# EAGLE design Pots (EAGLE 7.4.0)
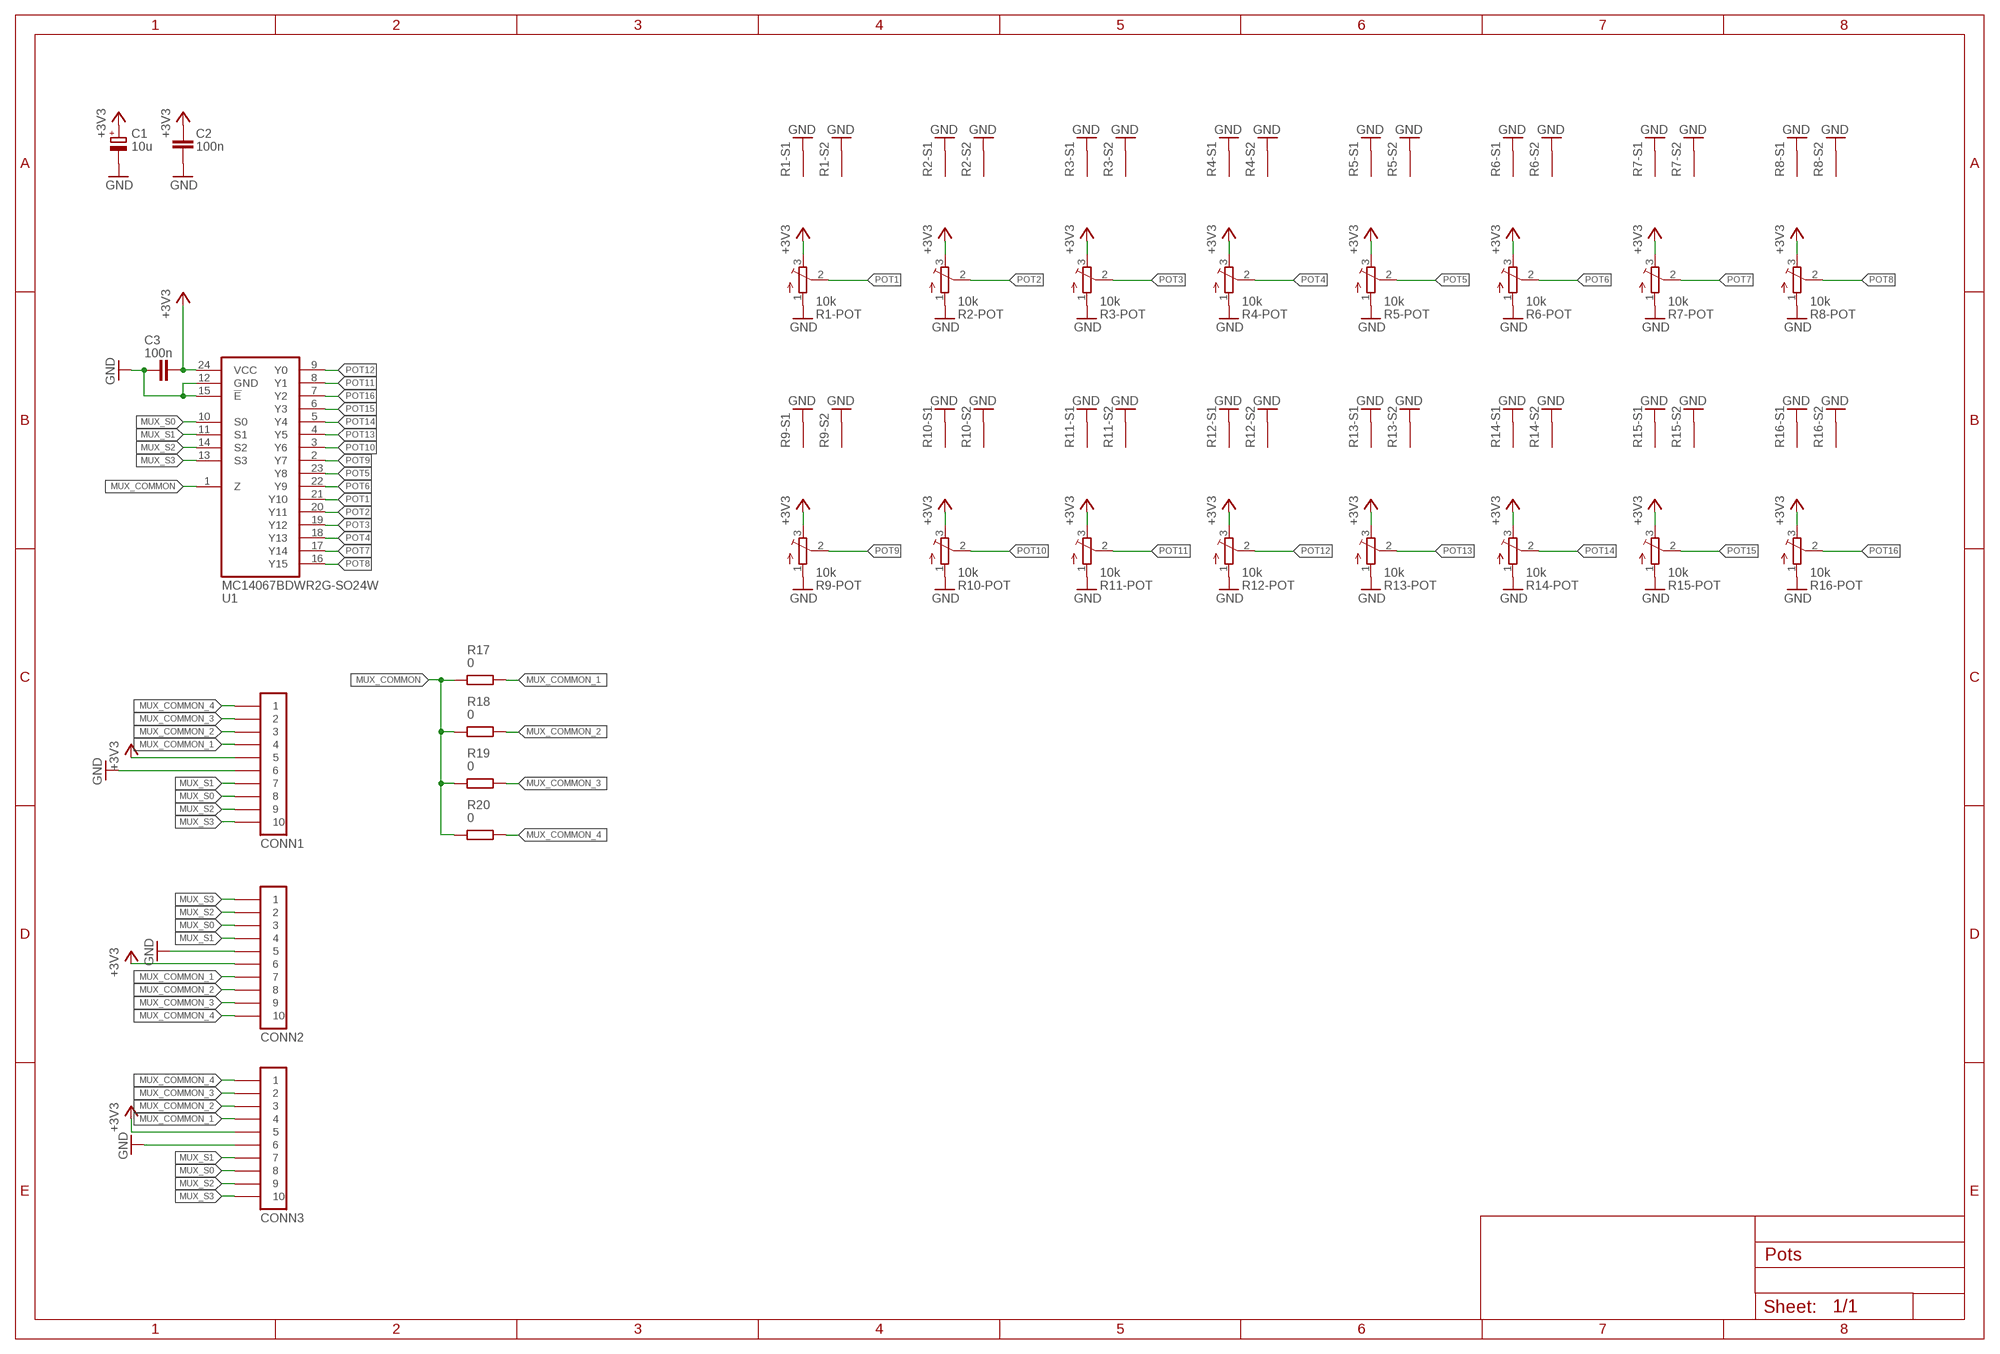
[diagram p0: schematic, sheet 1]

## Parts
C1  10u  ELECTROLYTIC_CAPACITOR-C-TH-E-0401  [C-TH-E-0401]
C2  100n  CAPACITOR-0805  [C0805]
C3  100n  CAPACITOR-0805  [C0805]
CONN1  PINHD-1X10-FFC-1MM-Z  [MOLEX-52271-1079]
CONN2  PINHD-1X10-FFC-1MM-Z  [MOLEX-52271-1079]
CONN3  PINHD-1X10-FFC-1MM-Z  [MOLEX-52271-1079]
R1  10k  PTV09A-4025F-B103  [PTV09A-4025F-B103]
R2  10k  PTV09A-4025F-B103  [PTV09A-4025F-B103]
R3  10k  PTV09A-4025F-B103  [PTV09A-4025F-B103]
R4  10k  PTV09A-4025F-B103  [PTV09A-4025F-B103]
R5  10k  PTV09A-4025F-B103  [PTV09A-4025F-B103]
R6  10k  PTV09A-4025F-B103  [PTV09A-4025F-B103]
R7  10k  PTV09A-4025F-B103  [PTV09A-4025F-B103]
R8  10k  PTV09A-4025F-B103  [PTV09A-4025F-B103]
R9  10k  PTV09A-4025F-B103  [PTV09A-4025F-B103]
R10  10k  PTV09A-4025F-B103  [PTV09A-4025F-B103]
R11  10k  PTV09A-4025F-B103  [PTV09A-4025F-B103]
R12  10k  PTV09A-4025F-B103  [PTV09A-4025F-B103]
R13  10k  PTV09A-4025F-B103  [PTV09A-4025F-B103]
R14  10k  PTV09A-4025F-B103  [PTV09A-4025F-B103]
R15  10k  PTV09A-4025F-B103  [PTV09A-4025F-B103]
R16  10k  PTV09A-4025F-B103  [PTV09A-4025F-B103]
R17  0  RESISTOR-0805  [R0805]
R18  0  RESISTOR-0805  [R0805]
R19  0  RESISTOR-0805  [R0805]
R20  0  RESISTOR-0805  [R0805]
U1  MC14067BDWR2G-SO24W  [SO24-W]

## Nets
+3V3: C1.+ C2.1 C3.2 CONN1.5 CONN2.6 CONN3.5 R1.3 R2.3 R3.3 R4.3 R5.3 R6.3 R7.3 R8.3 R9.3 R10.3 R11.3 R12.3 R13.3 R14.3 R15.3 R16.3 U1.24(VCC)
GND: C1.- C2.2 C3.1 CONN1.6 CONN2.5 CONN3.6 R1.1 R1.S1(-S1:S) R1.S2(-S2:S) R2.1 R2.S1(-S1:S) R2.S2(-S2:S) R3.1 R3.S1(-S1:S) R3.S2(-S2:S) R4.1 R4.S1(-S1:S) R4.S2(-S2:S) R5.1 R5.S1(-S1:S) R5.S2(-S2:S) R6.1 R6.S1(-S1:S) R6.S2(-S2:S) R7.1 R7.S1(-S1:S) R7.S2(-S2:S) R8.1 R8.S1(-S1:S) R8.S2(-S2:S) R9.1 R9.S1(-S1:S) R9.S2(-S2:S) R10.1 R10.S1(-S1:S) R10.S2(-S2:S) R11.1 R11.S1(-S1:S) R11.S2(-S2:S) R12.1 R12.S1(-S1:S) R12.S2(-S2:S) R13.1 R13.S1(-S1:S) R13.S2(-S2:S) R14.1 R14.S1(-S1:S) R14.S2(-S2:S) R15.1 R15.S1(-S1:S) R15.S2(-S2:S) R16.1 R16.S1(-S1:S) R16.S2(-S2:S) U1.12(GND) U1.15(!E)
MUX_COMMON: R17.1 R18.1 R19.1 R20.1 U1.1(Z)
MUX_COMMON_1: CONN1.4 CONN2.7 CONN3.4 R17.2
MUX_COMMON_2: CONN1.3 CONN2.8 CONN3.3 R18.2
MUX_COMMON_3: CONN1.2 CONN2.9 CONN3.2 R19.2
MUX_COMMON_4: CONN1.1 CONN2.10 CONN3.1 R20.2
MUX_S0: CONN1.8 CONN2.3 CONN3.8 U1.10(S0)
MUX_S1: CONN1.7 CONN2.4 CONN3.7 U1.11(S1)
MUX_S2: CONN1.9 CONN2.2 CONN3.9 U1.14(S2)
MUX_S3: CONN1.10 CONN2.1 CONN3.10 U1.13(S3)
POT1: R1.2 U1.21(Y10)
POT2: R2.2 U1.20(Y11)
POT3: R3.2 U1.19(Y12)
POT4: R4.2 U1.18(Y13)
POT5: R5.2 U1.23(Y8)
POT6: R6.2 U1.22(Y9)
POT7: R7.2 U1.17(Y14)
POT8: R8.2 U1.16(Y15)
POT9: R9.2 U1.2(Y7)
POT10: R10.2 U1.3(Y6)
POT11: R11.2 U1.8(Y1)
POT12: R12.2 U1.9(Y0)
POT13: R13.2 U1.4(Y5)
POT14: R14.2 U1.5(Y4)
POT15: R15.2 U1.6(Y3)
POT16: R16.2 U1.7(Y2)

## Library data of the parts
C1 = igor_lbr:ELECTROLYTIC_CAPACITOR: Electrolytic capacitor
C2 C3 = igor_lbr:CAPACITOR: Capacitor
CONN1-CONN3 = igor_lbr:PINHD-1X10: Pin header; MANUFACTURER: Molex; MPN: 52271-1079
R1-R16 = igor_lbr:PTV09A-4025F-B103: Potentiometer
R17-R20 = igor_lbr:RESISTOR: Resistor
U1 = igor_lbr:MC14067BDWR2G: 16-Channel Analog Multiplexer/Demultiplexer; MANUFACTURER: ON Semiconductor; MPN: MC14067BDWR2G

## Board
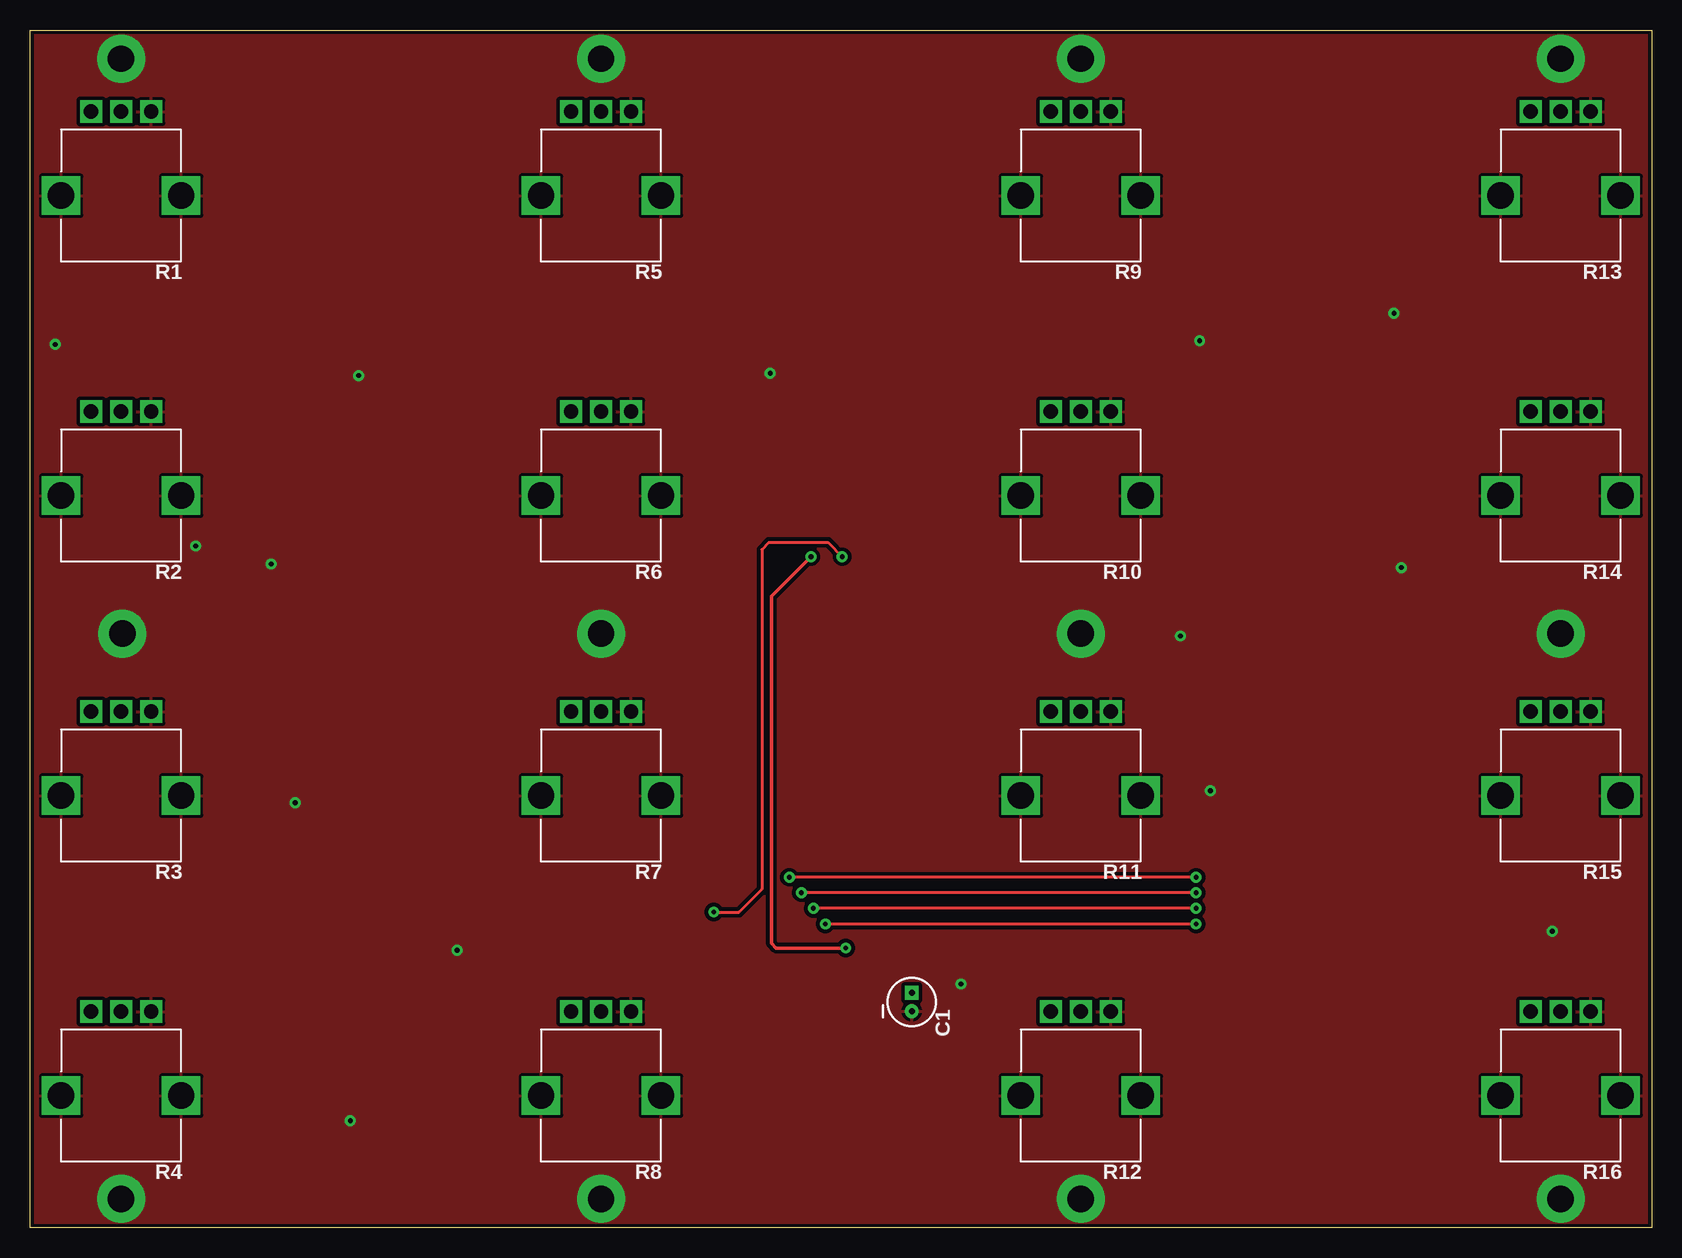
[diagram p1: board, top side]
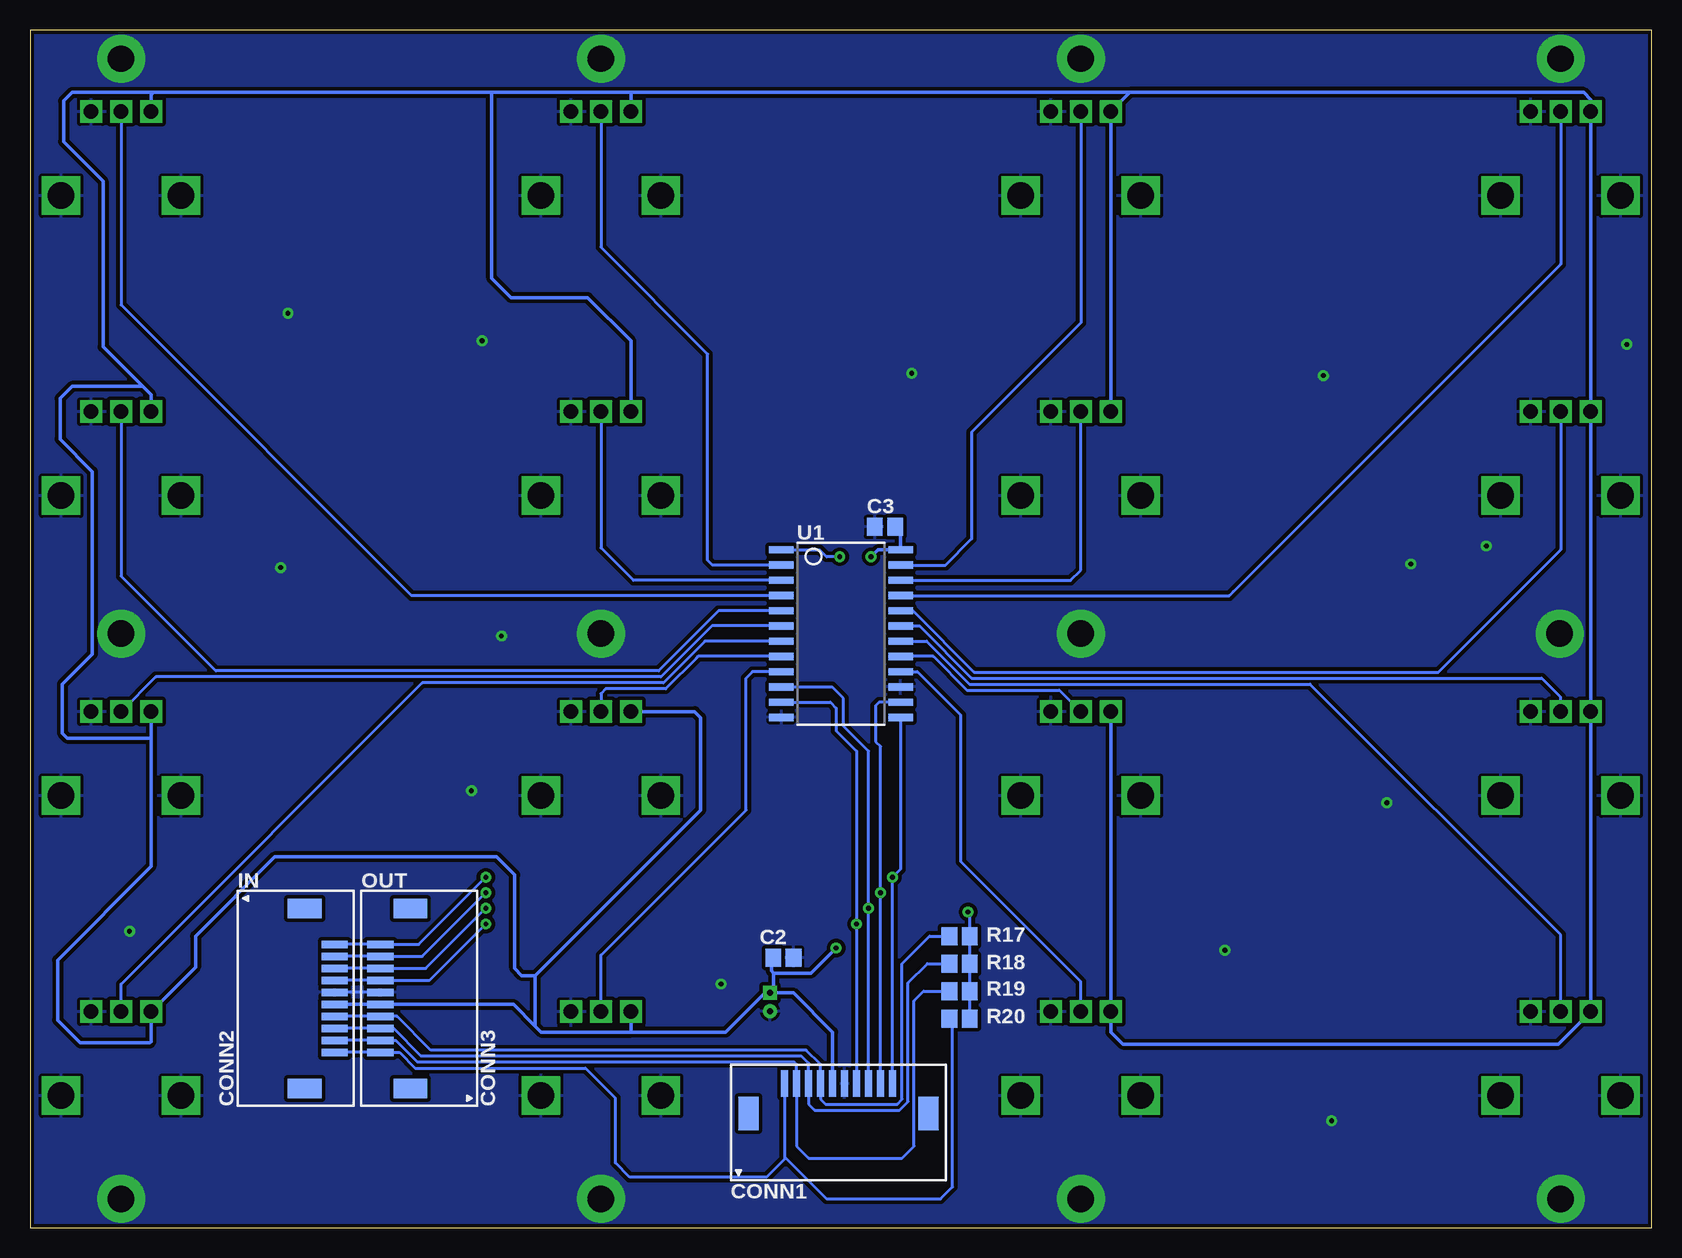
[diagram p2: board, bottom side, seen from below]

Size 135.2 x 99.8 mm. Coordinates in mm from the lower left corner, seen from the top.
Outline: 0,99.8 135.2,99.8 135.2,0 0,0 0,99.8
Copper layers (1*16): Top 0.035mm / dielectric 1.5mm / Bottom 0.035mm
Design rules "smiery": minimum track width 10mil, minimum drill 12mil, track to track 7mil, track to pad 5mil, pad to pad 5mil, via to via 6mil, smd to smd 0mil, copper to edge 12mil, drill to drill 10mil, minimum pad ring 13mil, minimum via ring 10mil, stop-mask expansion 2mil, vias tented up to drill 25mil, thermal gap 10mil

### Footprints (pad centres in the part's own frame; a part is rotated, then mirrored left to right if it is on the bottom)
C-TH-E-0401 = drill 0.5 square: + 0.77,0 | drill 0.5: - -0.77,0
C0805 = smd 1.3 x 1.5: 1 -0.85,0; 2 0.85,0
MOLEX-52271-1079 = smd 0.6 x 2.2: 1 -4.5,3.5; 2 -3.5,3.5; 3 -2.5,3.5; 4 -1.5,3.5; 5 -0.5,3.5; 6 0.5,3.5; 7 1.5,3.5; 8 2.5,3.5; 9 3.5,3.5; 10 4.5,3.5 | smd 1.65 x 2.8: S1 -7.5,1; S2 7.5,1
PTV09A-4025F-B103 = drill 1.2 square: 1 -2.5,-7; 2 0,-7; 3 2.5,-7 | drill 2.2 square: S1 -5,0; S2 5,0
R0805 = smd 1.3 x 1.5: 1 -0.85,0; 2 0.85,0
SO24-W = smd 2.032 x 0.6: 1 -4.975,6.985; 2 -4.975,5.715; 3 -4.975,4.445; 4 -4.975,3.175; 5 -4.975,1.905; 6 -4.975,0.635; 7 -4.975,-0.635; 8 -4.975,-1.905; 9 -4.975,-3.175; 10 -4.975,-4.445; 11 -4.975,-5.715; 12 -4.975,-6.985; 13 4.975,-6.985; 14 4.975,-5.715; 15 4.975,-4.445; 16 4.975,-3.175; 17 4.975,-1.905; 18 4.975,-0.635; 19 4.975,0.635; 20 4.975,1.905; 21 4.975,3.175; 22 4.975,4.445; 23 4.975,5.715; 24 4.975,6.985

### Placement (x,y rotation side)
C1  73.5,18.8 90 top
C2  72.4,22.5 0 bottom
C3  63.93,58.39 0 bottom
CONN1  67.8,8.5 0 bottom
CONN2  113.3,19.1 270 bottom
CONN3  102.5,19.1 90 bottom
R1  7.6,86 180 top
R2  7.6,61 180 top
R3  7.6,36 180 top
R4  7.6,11 180 top
R5  47.6,86 180 top
R6  47.6,61 180 top
R7  47.6,36 180 top
R8  47.6,11 180 top
R9  87.6,86 180 top
R10  87.6,61 180 top
R11  87.6,36 180 top
R12  87.6,11 180 top
R13  127.6,86 180 top
R14  127.6,61 180 top
R15  127.6,36 180 top
R16  127.6,11 180 top
R17  57.7,24.3 180 bottom
R18  57.7,22 180 bottom
R19  57.7,19.7 180 bottom
R20  57.7,17.4 180 bottom
U1  67.6,49.5 0 bottom

### Tracks (layer width: path | path; a pad name or v marks a point on that pad's centre or on a via)
+3V3  (via drill 0.4 pad 0.6)
  Top 0.305: v68,23.3 62.2,23.3 61.8,23.7 61.8,52.6 v65.1,55.9
  Bottom 0.305: v68,23.3 70.1,21.2 73.2,21.2 | 73.2,21.2 73.4,21.4 73.4,22.35 C2.1 | 43.5,94.6 5.7,94.6 5.1,94 R1.3 R2.3 R3.3 R4.3 7.8,15.3 44.1,15.3 45.1,16.3 R8.3 R7.3 | 43.5,94.6 R5.3 R6.3 | 124.9,94.6 131.7,94.6 132.4,93.9 132.4,90.5 129.1,87.2 129.1,73.4 125.8,70.1 | 124.9,94.6 96.6,94.6 | 96.6,94.6 85.1,94.6 | 85.1,94.6 43.5,94.6 | R9.3 85.1,94.6 | CONN1.5 68.3,16.3 71.57,19.57 C1.+ | 63.12,58.34 C3.2 62.62,57.94 U1.24 64.52,56.48 v65.1,55.9 | R12.3 85.1,16.3 | R15.3 125.1,40.8 | 125.1,40.8 125.1,30.1 132.9,22.3 132.9,17.3 131,15.4 125.2,15.4 125.1,15.5 R16.3 121.4,21.7 121.4,24.3 114.8,30.9 96.3,30.9 94.8,29.4 94.8,21.6 94.2,21 93.1,21 | R14.3 125.1,69.4 125.8,70.1 | 125.8,70.1 131.7,70.1 132.7,69.1 132.7,65.7 130,63 130,47.8 132.5,45.3 132.5,41.2 132.1,40.8 125.1,40.8 | R11.3 79.8,43 79.3,42.5 79.3,34.8 93.1,21 | R10.3 85.1,73.9 88.7,77.5 95.1,77.5 96.7,79.1 96.7,94.5 96.6,94.6 | R13.3 125.1,94.4 124.9,94.6 | 93.1,21 93.1,16.8 | 93.1,16.8 92.6,16.3 85.1,16.3 | 85.1,16.3 77.2,16.3 73.93,19.57 C1.+ | 93.1,16.8 94.9,18.6 CONN3.5 CONN2.6 | 73.2,21.2 73.2,19.87 C1.+
GND  (via drill 0.4 pad 0.6, 2.2 pad 4)
  Bottom 0.254: CONN3.6 CONN2.5
  other vias: 35.6,23.1 13.8,56.8 7.6,97.4 47.6,97.4 7.7,49.5 47.6,49.5 47.6,2.4 7.6,2.4 87.6,97.4 127.6,97.4 87.6,49.5 127.6,49.5 87.6,2.4 127.6,2.4 22.1,35.4 20.1,55.3 27.4,71 61.7,71.2 97.5,73.9 113.7,76.2 98.4,36.4 95.9,49.3 114.3,55 126.9,24.7 77.6,20.3 26.7,8.9 2.1,73.6
  pour Top (isolate 0.305): 0,99.8 135.2,99.8 135.2,0 0,0
  pour Bottom (isolate 0.305): 0,99.8 135.2,99.8 135.2,0 0,0
MUX_COMMON  (via drill 0.4 pad 0.6)
  Top 0.254: v67.7,55.9 66.5,57.1 61.6,57.1 61,56.5 61,28.2 59.1,26.3 v57,26.3
  Bottom 0.254: R20.1 R19.1 R18.1 R17.1 56.85,26.15 v57,26.3 | v67.7,55.9 68.8,55.9 69.39,56.48 U1.1
MUX_COMMON_1
  Bottom 0.254: CONN2.7 CONN3.4 104.6,17.6 101.8,14.8 70.5,14.8 69.3,13.6 CONN1.4 69.3,10.7 68.9,10.3 62.9,10.3 62.5,10.7 62.5,22 60.2,24.3 R17.2
MUX_COMMON_2
  Bottom 0.254: CONN2.8 CONN3.3 104.9,16.6 102.6,14.3 70.9,14.3 70.3,13.7 CONN1.3 70.3,10.3 69.8,9.8 62.7,9.8 62,10.5 62,20.4 60.4,22 R18.2
MUX_COMMON_3
  Bottom 0.254: CONN2.9 CONN3.2 104.7,15.6 102.9,13.8 71.5,13.8 71.3,13.6 CONN1.2 71.3,6.8 70.3,5.8 62.5,5.8 61.5,6.8 61.5,18.9 60.7,19.7 R19.2
MUX_COMMON_4
  Bottom 0.254: CONN2.10 CONN3.1 104.4,14.6 103.1,13.3 88.9,13.3 86.4,10.8 86.4,5.4 85.2,4.2 73.8,4.2 72.3,5.7 CONN1.1 72.3,5.9 68.8,2.4 59.3,2.4 58.3,3.4 58.3,17.15 R20.2
MUX_S0  (via drill 0.4 pad 0.6)
  Top 0.254: v97.2,26.6 v65.3,26.6
  Bottom 0.254: CONN1.8 v65.3,26.6 65.3,39.7 67.4,41.8 67.4,44.1 68.36,45.05 U1.10 | v97.2,26.6 102.2,21.6 CONN3.8 CONN2.3
MUX_S1  (via drill 0.4 pad 0.6)
  Top 0.254: v97.2,25.3 v66.3,25.3
  Bottom 0.254: CONN1.7 v66.3,25.3 66.3,39.7 68,41.4 68,43.3 68.48,43.78 U1.11 | v97.2,25.3 101.9,20.6 CONN3.7 CONN2.4
MUX_S2  (via drill 0.4 pad 0.6)
  Top 0.254: v97.2,27.9 v64.3,27.9
  Bottom 0.254: CONN1.9 v64.3,27.9 64.3,40.1 64.7,40.5 64.7,43.5 64.42,43.78 U1.14 | v97.2,27.9 102.5,22.6 CONN3.9 CONN2.2
MUX_S3  (via drill 0.4 pad 0.6)
  Top 0.254: v97.2,29.2 v63.3,29.2
  Bottom 0.254: CONN1.10 v63.3,29.2 62.62,29.88 U1.13 | v97.2,29.2 102.8,23.6 CONN3.10 CONN2.1
POT1
  Bottom 0.254: R1.2 7.6,80.3 34.9,53 35.23,52.67 U1.21
POT2
  Bottom 0.254: R2.2 7.6,56.5 17.8,46.3 56.5,46.3 61.6,51.41 U1.20
POT3
  Bottom 0.254: R3.2 7.6,44.2 9.2,45.8 56.7,45.8 61.03,50.13 U1.19
POT4
  Bottom 0.254: R4.2 7.6,24.4 28.5,45.3 56.9,45.3 60.47,48.87 U1.18
POT5
  Bottom 0.254: R5.2 47.6,75.4 56.7,66.3 56.7,57.4 58.88,55.22 U1.23
POT6
  Bottom 0.254: R6.2 47.6,54.8 48.45,53.95 U1.22
POT7
  Bottom 0.254: R7.2 49.4,44.8 57.1,44.8 59.9,47.59 U1.17
POT8
  Bottom 0.254: R8.2 47.6,20.5 57.6,30.5 57.6,42.7 61.23,46.33 U1.16
POT9
  Bottom 0.254: R9.2 87.6,81.7 78.7,72.8 78.7,55.6 78.31,55.22 U1.2
POT10
  Bottom 0.254: R10.2 87.6,56.65 84.9,53.95 U1.3
POT11
  Bottom 0.254: 79.5,47.6 79.5,47.59 | R11.2 87.6,44.5 87.2,44.9 82.2,44.9 79.65,47.45 79.5,47.59 | U1.8 79.5,47.59
POT12
  Bottom 0.254: R12.2 87.6,22.7 75.5,34.8 75.5,45.8 74.97,46.33 U1.9
POT13
  Bottom 0.254: R13.2 127.6,76.9 103.38,52.67 U1.4
POT14
  Bottom 0.254: R14.2 127.6,54.3 119.7,46.4 82.8,46.4 77.8,51.41 U1.5
POT15
  Bottom 0.254: R15.2 124.7,45.9 82.6,45.9 78.36,50.13 U1.6
POT16
  Bottom 0.254: R16.2 127.6,20.3 102.5,45.4 82.4,45.4 78.94,48.87 U1.7

### Text on the board
bNames: OUT | IN